# EAGLE design piezo-layer_v0.95-R002 (EAGLE 6.5.0)
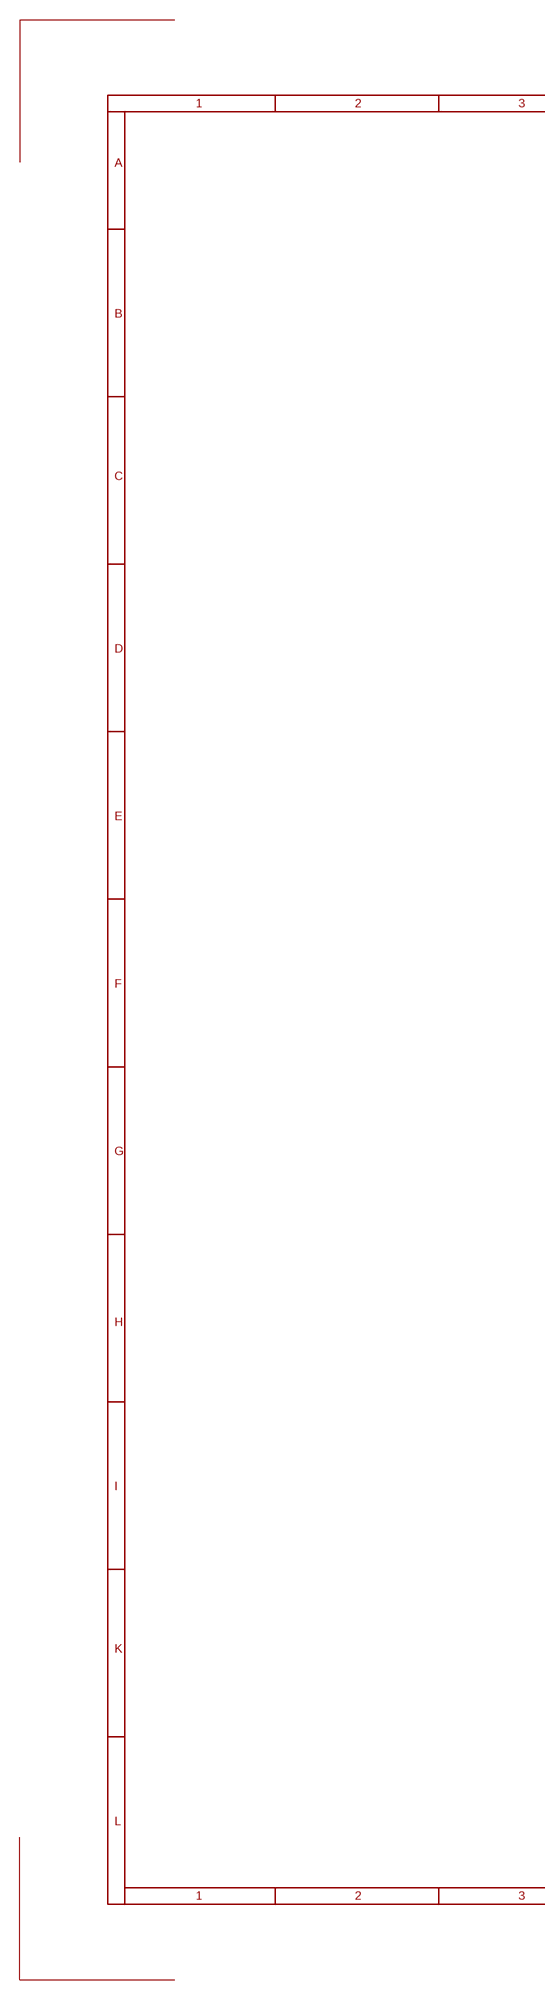
[diagram p0: schematic, sheet 1, part 1 of 2]
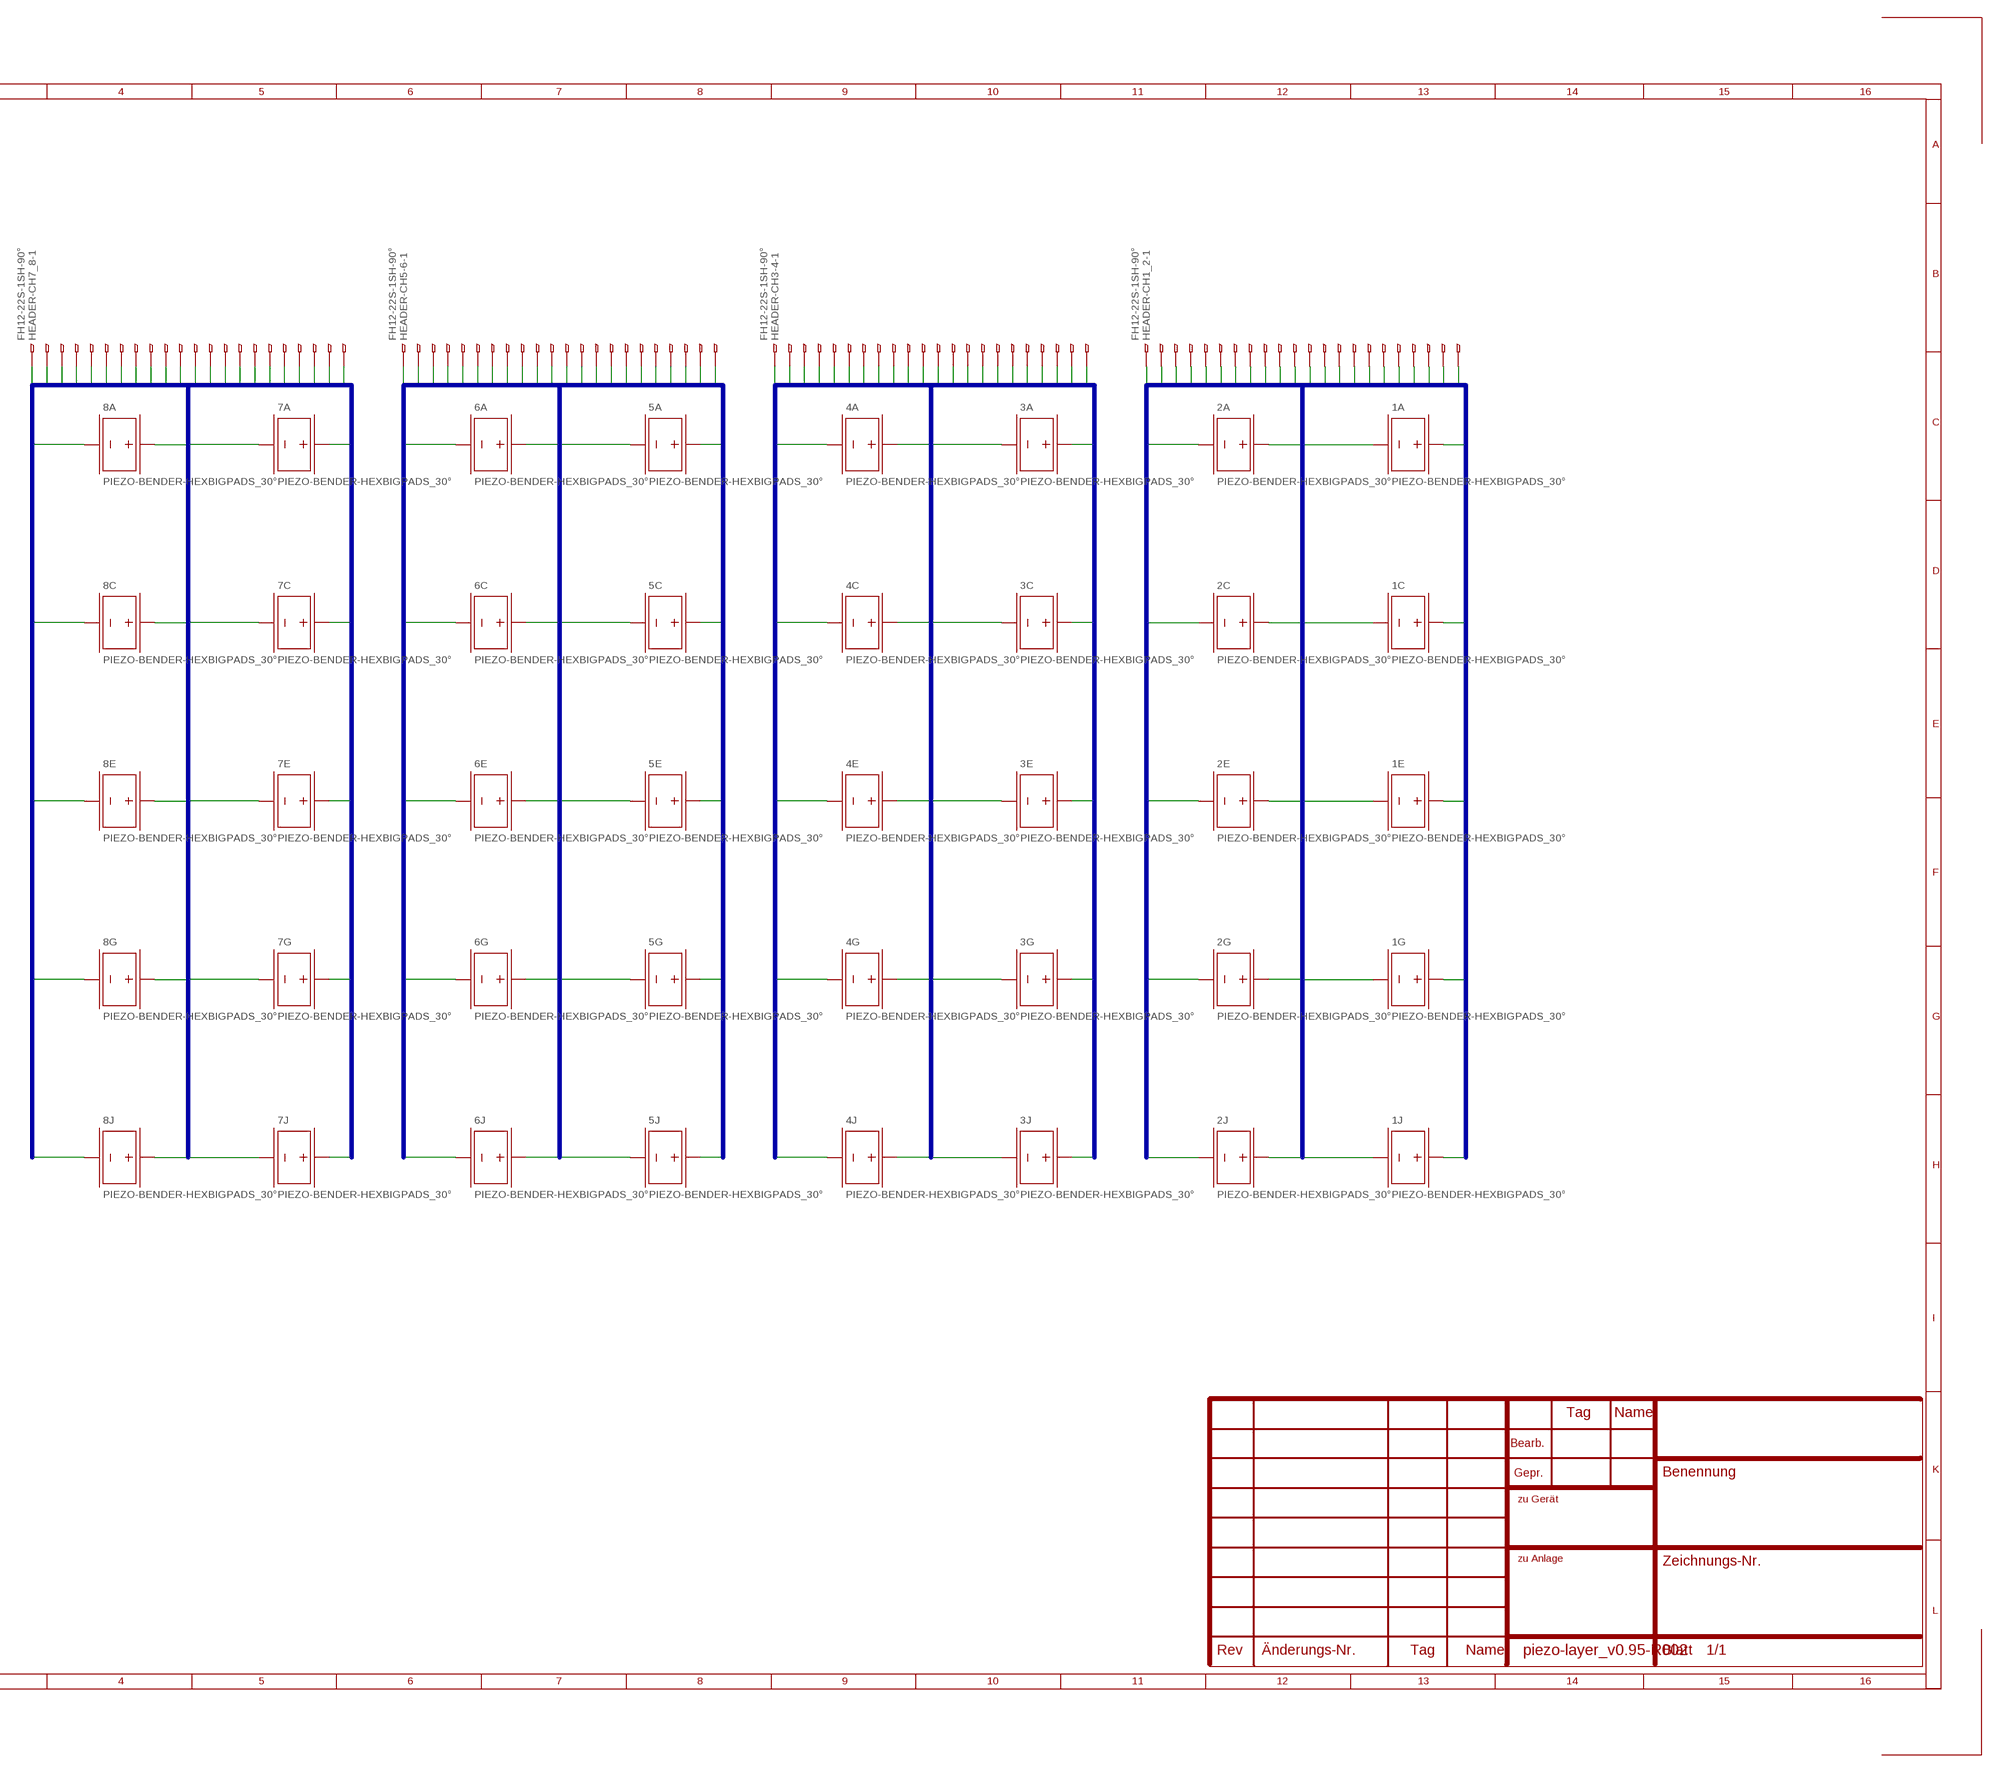
[diagram p1: schematic, sheet 1, part 2 of 2]

## Parts
1A  PIEZO-BENDER-HEXBIGPADS_30°  [PIEZO-BENDER-HEX_16MM_BIGPAD-30°]
1C  PIEZO-BENDER-HEXBIGPADS_30°  [PIEZO-BENDER-HEX_16MM_BIGPAD-30°]
1E  PIEZO-BENDER-HEXBIGPADS_30°  [PIEZO-BENDER-HEX_16MM_BIGPAD-30°]
1G  PIEZO-BENDER-HEXBIGPADS_30°  [PIEZO-BENDER-HEX_16MM_BIGPAD-30°]
1J  PIEZO-BENDER-HEXBIGPADS_30°  [PIEZO-BENDER-HEX_16MM_BIGPAD-30°]
2A  PIEZO-BENDER-HEXBIGPADS_30°  [PIEZO-BENDER-HEX_16MM_BIGPAD-30°]
2C  PIEZO-BENDER-HEXBIGPADS_30°  [PIEZO-BENDER-HEX_16MM_BIGPAD-30°]
2E  PIEZO-BENDER-HEXBIGPADS_30°  [PIEZO-BENDER-HEX_16MM_BIGPAD-30°]
2G  PIEZO-BENDER-HEXBIGPADS_30°  [PIEZO-BENDER-HEX_16MM_BIGPAD-30°]
2J  PIEZO-BENDER-HEXBIGPADS_30°  [PIEZO-BENDER-HEX_16MM_BIGPAD-30°]
3A  PIEZO-BENDER-HEXBIGPADS_30°  [PIEZO-BENDER-HEX_16MM_BIGPAD-30°]
3C  PIEZO-BENDER-HEXBIGPADS_30°  [PIEZO-BENDER-HEX_16MM_BIGPAD-30°]
3E  PIEZO-BENDER-HEXBIGPADS_30°  [PIEZO-BENDER-HEX_16MM_BIGPAD-30°]
3G  PIEZO-BENDER-HEXBIGPADS_30°  [PIEZO-BENDER-HEX_16MM_BIGPAD-30°]
3J  PIEZO-BENDER-HEXBIGPADS_30°  [PIEZO-BENDER-HEX_16MM_BIGPAD-30°]
4A  PIEZO-BENDER-HEXBIGPADS_30°  [PIEZO-BENDER-HEX_16MM_BIGPAD-30°]
4C  PIEZO-BENDER-HEXBIGPADS_30°  [PIEZO-BENDER-HEX_16MM_BIGPAD-30°]
4E  PIEZO-BENDER-HEXBIGPADS_30°  [PIEZO-BENDER-HEX_16MM_BIGPAD-30°]
4G  PIEZO-BENDER-HEXBIGPADS_30°  [PIEZO-BENDER-HEX_16MM_BIGPAD-30°]
4J  PIEZO-BENDER-HEXBIGPADS_30°  [PIEZO-BENDER-HEX_16MM_BIGPAD-30°]
5A  PIEZO-BENDER-HEXBIGPADS_30°  [PIEZO-BENDER-HEX_16MM_BIGPAD-30°]
5C  PIEZO-BENDER-HEXBIGPADS_30°  [PIEZO-BENDER-HEX_16MM_BIGPAD-30°]
5E  PIEZO-BENDER-HEXBIGPADS_30°  [PIEZO-BENDER-HEX_16MM_BIGPAD-30°]
5G  PIEZO-BENDER-HEXBIGPADS_30°  [PIEZO-BENDER-HEX_16MM_BIGPAD-30°]
5J  PIEZO-BENDER-HEXBIGPADS_30°  [PIEZO-BENDER-HEX_16MM_BIGPAD-30°]
6A  PIEZO-BENDER-HEXBIGPADS_30°  [PIEZO-BENDER-HEX_16MM_BIGPAD-30°]
6C  PIEZO-BENDER-HEXBIGPADS_30°  [PIEZO-BENDER-HEX_16MM_BIGPAD-30°]
6E  PIEZO-BENDER-HEXBIGPADS_30°  [PIEZO-BENDER-HEX_16MM_BIGPAD-30°]
6G  PIEZO-BENDER-HEXBIGPADS_30°  [PIEZO-BENDER-HEX_16MM_BIGPAD-30°]
6J  PIEZO-BENDER-HEXBIGPADS_30°  [PIEZO-BENDER-HEX_16MM_BIGPAD-30°]
7A  PIEZO-BENDER-HEXBIGPADS_30°  [PIEZO-BENDER-HEX_16MM_BIGPAD-30°]
7C  PIEZO-BENDER-HEXBIGPADS_30°  [PIEZO-BENDER-HEX_16MM_BIGPAD-30°]
7E  PIEZO-BENDER-HEXBIGPADS_30°  [PIEZO-BENDER-HEX_16MM_BIGPAD-30°]
7G  PIEZO-BENDER-HEXBIGPADS_30°  [PIEZO-BENDER-HEX_16MM_BIGPAD-30°]
7J  PIEZO-BENDER-HEXBIGPADS_30°  [PIEZO-BENDER-HEX_16MM_BIGPAD-30°]
8A  PIEZO-BENDER-HEXBIGPADS_30°  [PIEZO-BENDER-HEX_16MM_BIGPAD-30°]
8C  PIEZO-BENDER-HEXBIGPADS_30°  [PIEZO-BENDER-HEX_16MM_BIGPAD-30°]
8E  PIEZO-BENDER-HEXBIGPADS_30°  [PIEZO-BENDER-HEX_16MM_BIGPAD-30°]
8G  PIEZO-BENDER-HEXBIGPADS_30°  [PIEZO-BENDER-HEX_16MM_BIGPAD-30°]
8J  PIEZO-BENDER-HEXBIGPADS_30°  [PIEZO-BENDER-HEX_16MM_BIGPAD-30°]
HEADER-CH1_2  FH12-22S-1SH-90°  [FH12-22S-1SH]
HEADER-CH3-4  FH12-22S-1SH-90°  [FH12-22S-1SH]
HEADER-CH5-6  FH12-22S-1SH-90°  [FH12-22S-1SH]
HEADER-CH7_8  FH12-22S-1SH-90°  [FH12-22S-1SH]

## Nets
BUS1: 1A.TOP(+_1) HEADER-CH1_2.22
BUS2: HEADER-CH1_2.21
BUS3: 1C.TOP(+_1) HEADER-CH1_2.20
BUS4: HEADER-CH1_2.19
BUS5: 1A.BOTTOM(-_1) 1C.BOTTOM(-_1) 1E.BOTTOM(-_1) 1G.BOTTOM(-_1) 1J.BOTTOM(-_1) HEADER-CH1_2.12 HEADER-CH1_2.18
BUS6: 1E.TOP(+_1) HEADER-CH1_2.17
BUS7: HEADER-CH1_2.16
BUS8: 1G.TOP(+_1) HEADER-CH1_2.15
BUS9: HEADER-CH1_2.14
BUS10: 1J.TOP(+_1) HEADER-CH1_2.13
BUS11: 2A.TOP(+_1) HEADER-CH1_2.11
BUS12: HEADER-CH1_2.10
BUS13: 2C.TOP(+_1) HEADER-CH1_2.9
BUS14: HEADER-CH1_2.8
BUS15: 2A.BOTTOM(-_1) 2C.BOTTOM(-_1) 2E.BOTTOM(-_1) 2G.BOTTOM(-_1) 2J.BOTTOM(-_1) HEADER-CH1_2.1 HEADER-CH1_2.7
BUS16: 2E.TOP(+_1) HEADER-CH1_2.6
BUS17: HEADER-CH1_2.5
BUS18: 2G.TOP(+_1) HEADER-CH1_2.4
BUS19: HEADER-CH1_2.3
BUS20: 2J.TOP(+_1) HEADER-CH1_2.2
BUS21: 3A.TOP(+_1) HEADER-CH3-4.22
BUS22: HEADER-CH3-4.21
BUS23: 3C.TOP(+_1) HEADER-CH3-4.20
BUS24: HEADER-CH3-4.19
BUS25: 3A.BOTTOM(-_1) 3C.BOTTOM(-_1) 3E.BOTTOM(-_1) 3G.BOTTOM(-_1) 3J.BOTTOM(-_1) HEADER-CH3-4.12 HEADER-CH3-4.18
BUS26: 3E.TOP(+_1) HEADER-CH3-4.17
BUS27: HEADER-CH3-4.16
BUS28: 3G.TOP(+_1) HEADER-CH3-4.15
BUS29: HEADER-CH3-4.14
BUS30: 3J.TOP(+_1) HEADER-CH3-4.13
BUS31: 4A.TOP(+_1) HEADER-CH3-4.11
BUS32: HEADER-CH3-4.10
BUS33: 4C.TOP(+_1) HEADER-CH3-4.9
BUS34: HEADER-CH3-4.8
BUS35: 4A.BOTTOM(-_1) 4C.BOTTOM(-_1) 4E.BOTTOM(-_1) 4G.BOTTOM(-_1) 4J.BOTTOM(-_1) HEADER-CH3-4.1 HEADER-CH3-4.7
BUS36: 4E.TOP(+_1) HEADER-CH3-4.6
BUS37: HEADER-CH3-4.5
BUS38: 4G.TOP(+_1) HEADER-CH3-4.4
BUS39: HEADER-CH3-4.3
BUS40: 4J.TOP(+_1) HEADER-CH3-4.2
BUS41: 5A.TOP(+_1) HEADER-CH5-6.22
BUS42: HEADER-CH5-6.21
BUS43: 5C.TOP(+_1) HEADER-CH5-6.20
BUS44: HEADER-CH5-6.19
BUS45: 5A.BOTTOM(-_1) 5C.BOTTOM(-_1) 5E.BOTTOM(-_1) 5G.BOTTOM(-_1) 5J.BOTTOM(-_1) HEADER-CH5-6.12 HEADER-CH5-6.18
BUS46: 5E.TOP(+_1) HEADER-CH5-6.17
BUS47: HEADER-CH5-6.16
BUS48: 5G.TOP(+_1) HEADER-CH5-6.15
BUS49: HEADER-CH5-6.14
BUS50: 5J.TOP(+_1) HEADER-CH5-6.13
BUS51: 6A.TOP(+_1) HEADER-CH5-6.11
BUS52: HEADER-CH5-6.10
BUS53: 6C.TOP(+_1) HEADER-CH5-6.9
BUS54: HEADER-CH5-6.8
BUS55: 6A.BOTTOM(-_1) 6C.BOTTOM(-_1) 6E.BOTTOM(-_1) 6G.BOTTOM(-_1) 6J.BOTTOM(-_1) HEADER-CH5-6.1 HEADER-CH5-6.7
BUS56: 6E.TOP(+_1) HEADER-CH5-6.6
BUS57: HEADER-CH5-6.5
BUS58: 6G.TOP(+_1) HEADER-CH5-6.4
BUS59: HEADER-CH5-6.3
BUS60: 6J.TOP(+_1) HEADER-CH5-6.2
BUS61: 7A.TOP(+_1) HEADER-CH7_8.22
BUS62: HEADER-CH7_8.21
BUS63: 7C.TOP(+_1) HEADER-CH7_8.20
BUS64: HEADER-CH7_8.19
BUS65: 7A.BOTTOM(-_1) 7C.BOTTOM(-_1) 7E.BOTTOM(-_1) 7G.BOTTOM(-_1) 7J.BOTTOM(-_1) HEADER-CH7_8.12 HEADER-CH7_8.18
BUS66: 7E.TOP(+_1) HEADER-CH7_8.17
BUS67: HEADER-CH7_8.16
BUS68: 7G.TOP(+_1) HEADER-CH7_8.15
BUS69: HEADER-CH7_8.14
BUS70: 7J.TOP(+_1) HEADER-CH7_8.13
BUS71: 8A.TOP(+_1) HEADER-CH7_8.11
BUS72: HEADER-CH7_8.10
BUS73: 8C.TOP(+_1) HEADER-CH7_8.9
BUS74: HEADER-CH7_8.8
BUS75: 8A.BOTTOM(-_1) 8C.BOTTOM(-_1) 8E.BOTTOM(-_1) 8G.BOTTOM(-_1) 8J.BOTTOM(-_1) HEADER-CH7_8.1 HEADER-CH7_8.7
BUS76: 8E.TOP(+_1) HEADER-CH7_8.6
BUS77: HEADER-CH7_8.5
BUS78: 8G.TOP(+_1) HEADER-CH7_8.4
BUS79: HEADER-CH7_8.3
BUS80: 8J.TOP(+_1) HEADER-CH7_8.2

## Buses
BUS[1..20]
BUS[21..40]
BUS[41..60]
BUS[61..80]

## Library data of the parts
1A 1C 1E 1G 1J 2A 2C 2E 2G 2J 3A 3C 3E 3G 3J 4A 4C 4E 4G 4J 5A 5C 5E 5G 5J 6A 6C 6E 6G 6J 7A 7C 7E 7G 7J 8A 8C 8E 8G 8J = ICST:PIEZO-BENDER-HEX
HEADER-CH1_2 HEADER-CH3-4 HEADER-CH5-6 HEADER-CH7_8 = ICST:FH12-22S-1SH

## Board
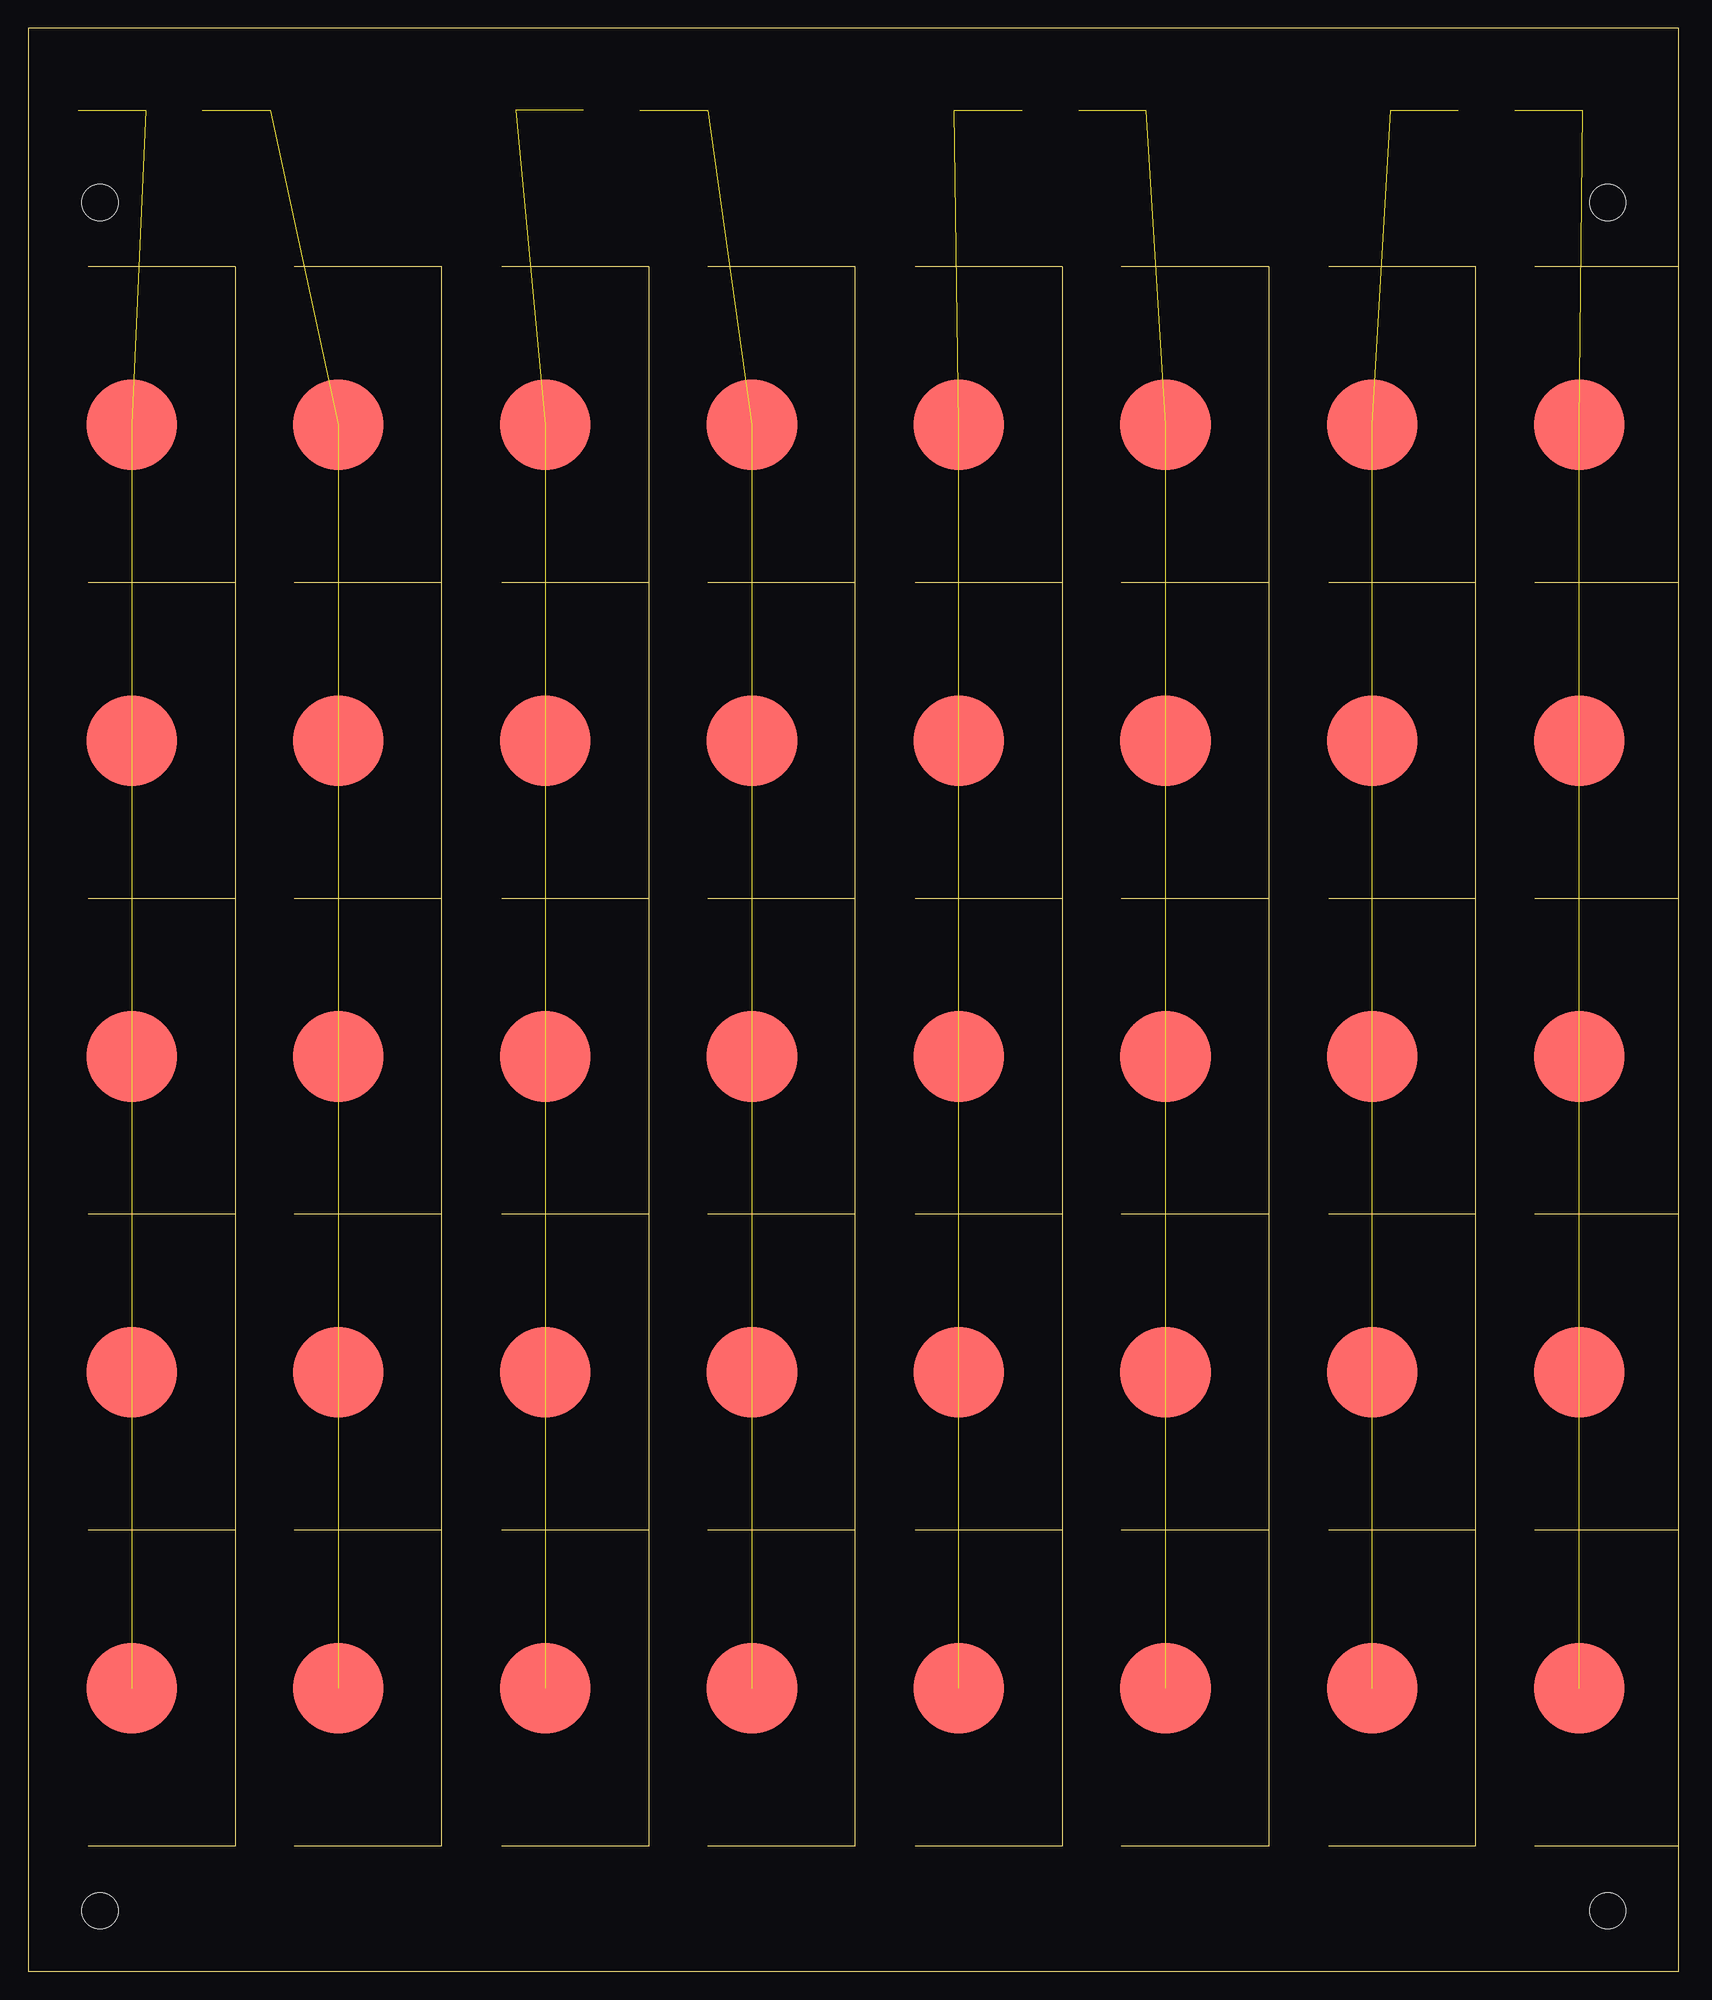
[diagram p2: board, top side]
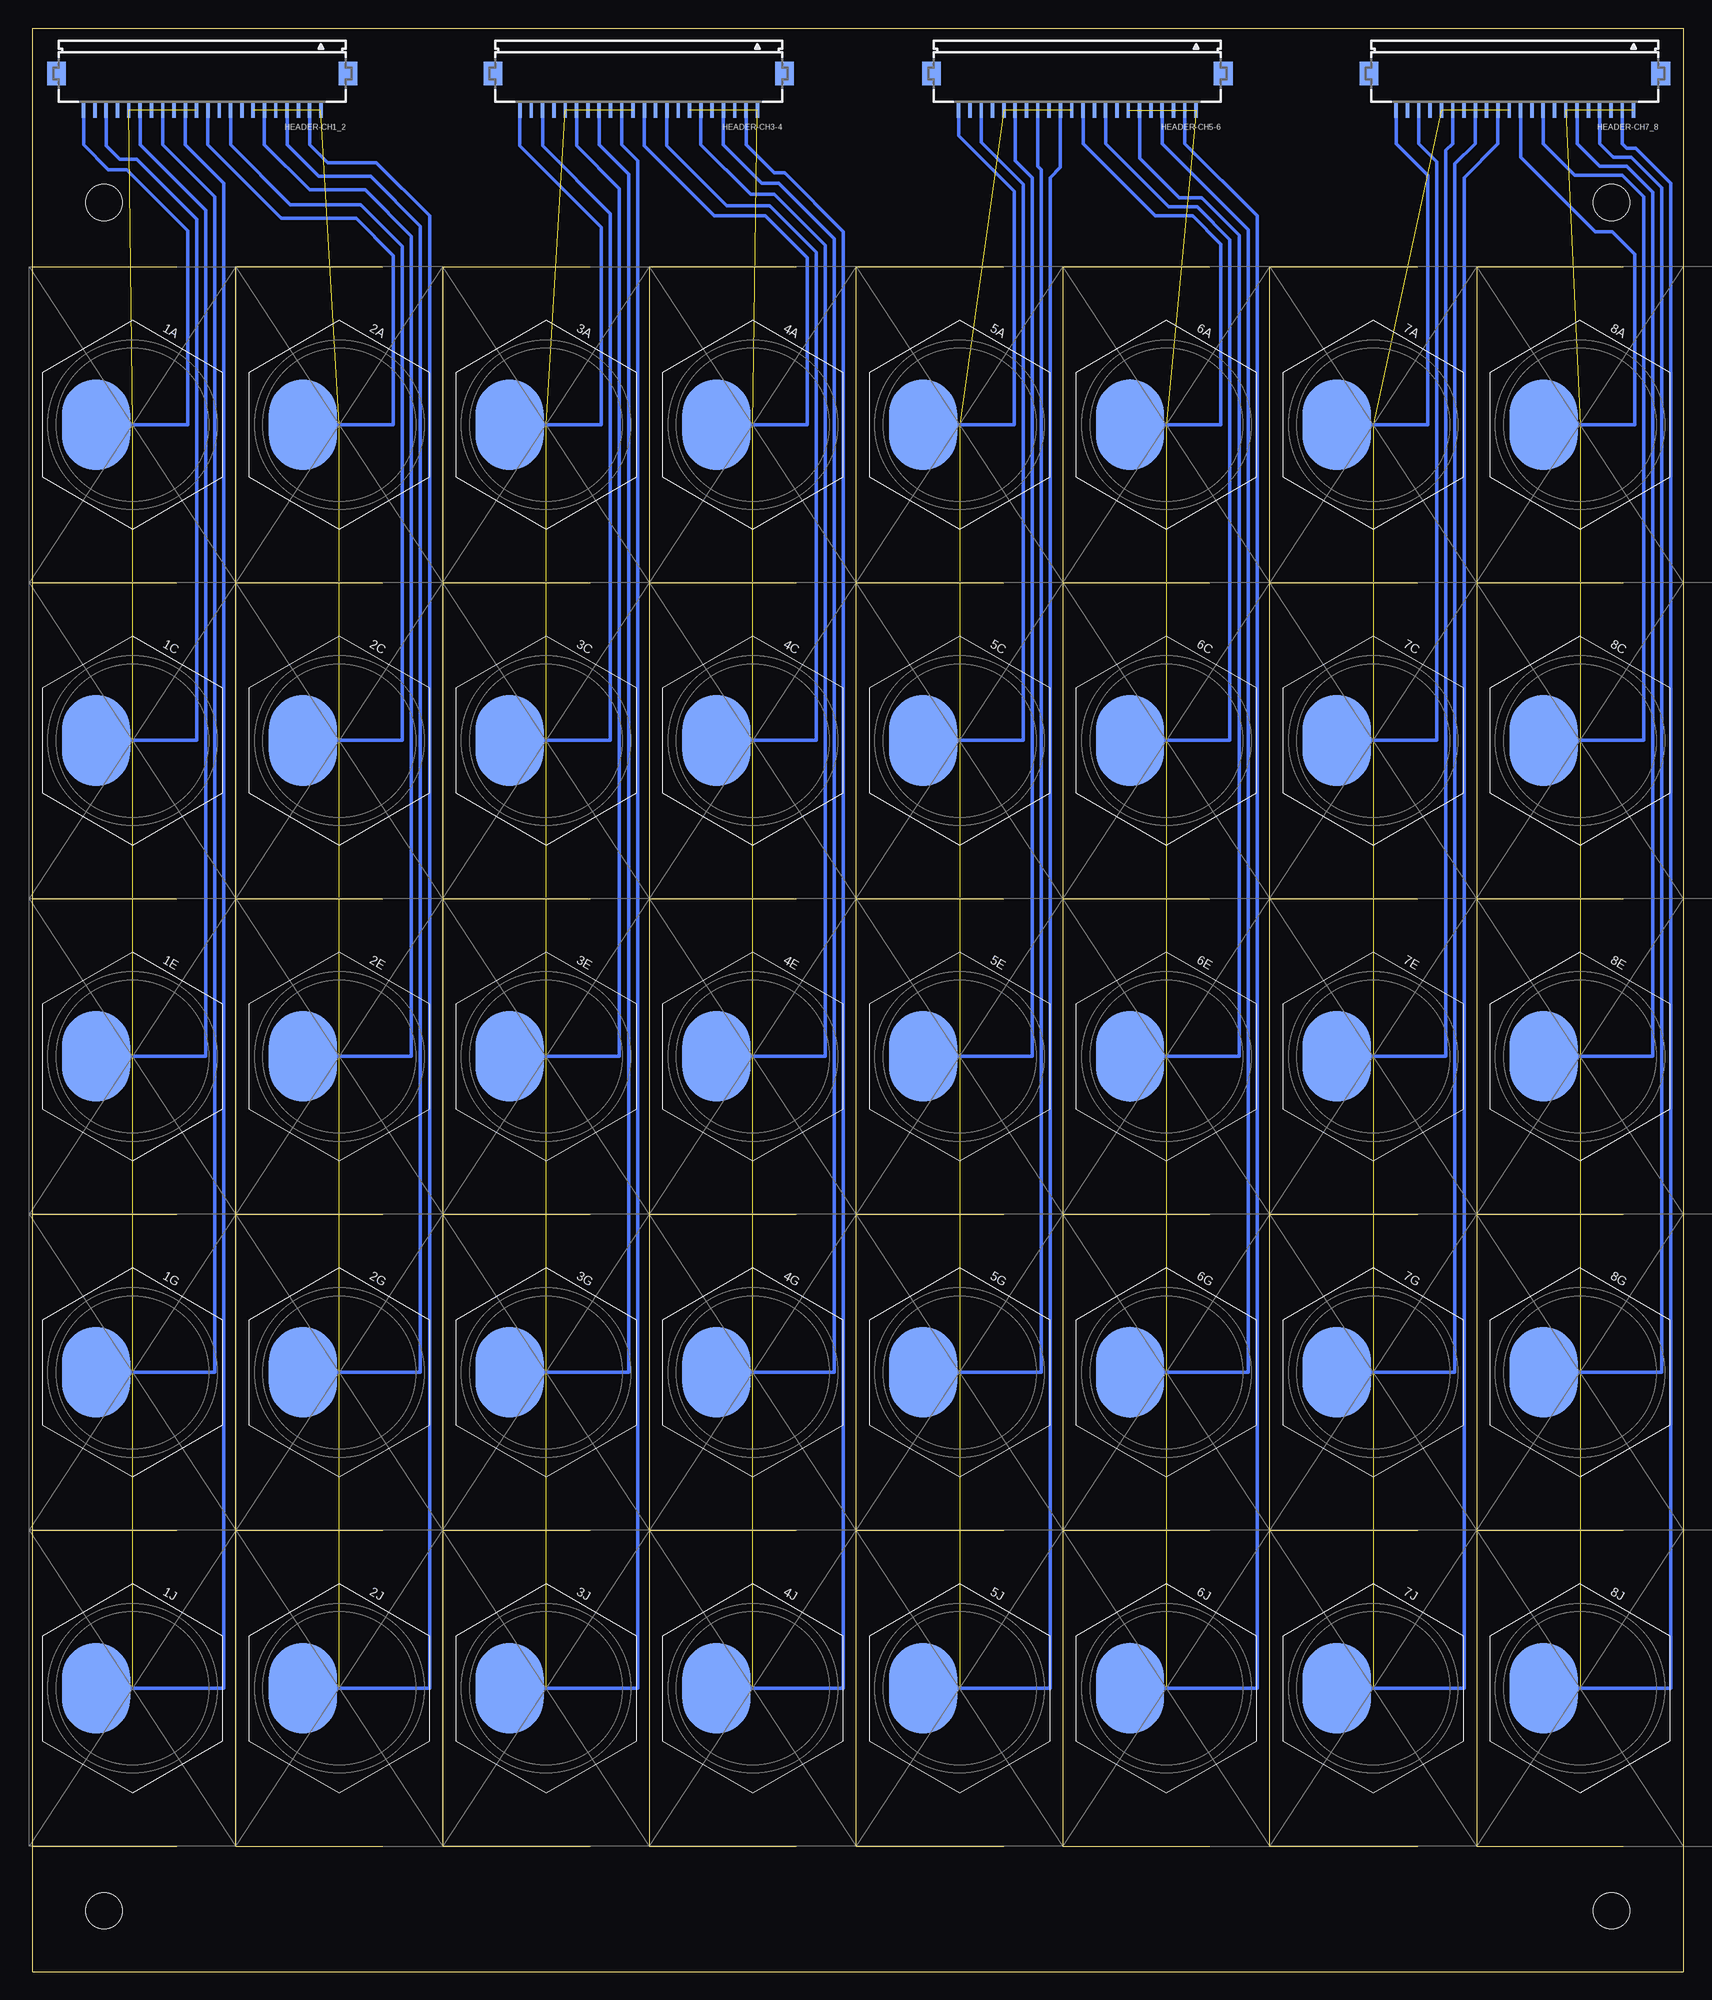
[diagram p3: board, bottom side, seen from below]

Size 146 x 171.9 mm. Coordinates in mm from the lower left corner, seen from the top.
Outline: 146,11.1 146,0 0,0 0,171.9 146,171.9 146,150.8
Outline: 146,11.1 146,39.04
Outline: 146,39.04 146,66.98
Outline: 146,66.98 146,94.92
Outline: 146,94.92 146,122.86
Outline: 146,122.86 146,150.8
Outline: 128.03,39.04 128.03,11.1 115.05,11.1
Outline: 128.03,39.04 128.03,66.98
Outline: 128.03,66.98 128.03,94.92
Outline: 128.03,94.92 128.03,122.86
Outline: 128.03,122.86 128.03,150.8 115.05,150.8
Outline: 109.74,122.86 109.74,150.8 96.67,150.8
Outline: 109.74,122.86 109.74,94.92
Outline: 109.74,94.92 109.74,66.98
Outline: 109.74,66.98 109.74,39.04
Outline: 109.74,39.04 109.74,11.1 96.67,11.1
Outline: 91.45,122.86 91.45,150.8 78.47,150.8
Outline: 91.45,122.86 91.45,94.92
Outline: 91.45,94.92 91.45,66.98
Outline: 91.45,66.98 91.45,39.04
Outline: 91.45,39.04 91.45,11.1 78.47,11.1
Outline: 73.16,122.86 73.16,11.1 60.09,11.1
Outline: 73.16,122.86 73.16,150.8 60.09,150.8
Outline: 54.87,122.86 54.87,150.8 41.89,150.8
Outline: 54.87,122.86 54.87,11.1 41.89,11.1
Outline: 128.03,122.86 115.05,122.86
Outline: 146,150.8 133.25,150.8
Outline: 146,122.86 133.25,122.86
Outline: 146,94.92 133.25,94.92
Outline: 128.03,94.92 115.05,94.92
Outline: 128.03,66.98 115.05,66.98
Outline: 146,66.98 133.25,66.98
Outline: 146,39.04 133.25,39.04
Outline: 128.03,39.04 115.05,39.04
Outline: 146,11.1 133.25,11.1
Outline: 109.74,122.86 96.67,122.86
Outline: 91.45,122.86 78.47,122.86
Outline: 109.74,94.92 96.67,94.92
Outline: 91.45,94.92 78.47,94.92
Outline: 91.45,66.98 78.47,66.98
Outline: 109.74,66.98 96.67,66.98
Outline: 109.74,39.04 96.67,39.04
Outline: 91.45,39.04 78.47,39.04
Outline: 73.16,94.92 60.09,94.92
Outline: 54.87,94.92 41.89,94.92
Outline: 73.16,66.98 60.09,66.98
Outline: 54.87,66.98 41.89,66.98
Outline: 73.16,39.04 60.11,39.04
Outline: 54.87,39.04 41.89,39.04
Outline: 23.51,150.8 36.58,150.8 36.58,11.1 23.51,11.1
Outline: 5.31,150.8 18.29,150.8 18.29,11.1 5.31,11.1
Outline: 36.58,122.86 23.51,122.86
Outline: 18.29,122.86 5.31,122.86
Outline: 36.58,94.92 23.51,94.92
Outline: 18.29,94.92 5.31,94.92
Outline: 18.29,66.98 5.31,66.98
Outline: 36.58,66.98 23.51,66.98
Outline: 36.58,39.04 23.51,39.04
Outline: 18.29,39.04 5.31,39.04
Outline: 73.16,122.86 60.09,122.86
Outline: 54.87,122.86 41.89,122.86
Copper layers 1*16: Top 0.012mm / dielectric 0.025mm / Bottom 0.012mm
Design rules "1L-0.025-0.15_0.3mm *": minimum track width 0.2mm, minimum drill 0.3mm, track to track 0.15mm, track to pad 0.15mm, pad to pad 0.15mm, via to via 0.15mm, smd to smd 0.15mm, copper to edge 0.5mm, drill to drill 1mm, minimum pad ring 10mil, minimum via ring 8mil, stop-mask expansion 4mil, vias tented up to drill 0mil, thermal gap 10mil
Holes 3.2 mm at 6.35,156.5 139.7,156.5 6.35,5.4 139.7,5.4

### Footprints (pad centres in the part's own frame; a part is rotated, then mirrored left to right if it is on the bottom)
PIEZO-BENDER-HEX_16MM_BIGPAD-30° = smd 8 x 8 bottom: BOTTOM 0,0 | smd 6 x 8 rotated 210: TOP -2.8,-1.6
FH12-22S-1SH = smd 0.3 x 1.3: 1 -10.5,3.25; 2 -9.5,3.25; 3 -8.5,3.25; 4 -7.5,3.25; 5 -6.5,3.25; 6 -5.5,3.25; 7 -4.5,3.25; 8 -3.5,3.25; 9 -2.5,3.25; 10 -1.5,3.25; 11 -0.5,3.25; 12 0.5,3.25; 13 1.5,3.25; 14 2.5,3.25; 15 3.5,3.25; 16 4.5,3.25; 17 5.5,3.25; 18 6.5,3.25; 19 7.5,3.25; 20 8.5,3.25; 21 9.5,3.25; 22 10.5,3.25 | smd 1.65 x 2.05: PAD1 -12.9,0; PAD2 12.9,0

### Placement (x,y rotation side)
1A  137.17,136.83 330 bottom
1C  137.17,108.89 330 bottom
1E  137.17,80.95 330 bottom
1G  137.17,53.01 330 bottom
1J  137.17,25.07 330 bottom
2A  118.88,136.83 330 bottom
2C  118.88,108.89 330 bottom
2E  118.88,80.95 330 bottom
2G  118.88,53.01 330 bottom
2J  118.88,25.07 330 bottom
3A  100.59,136.83 330 bottom
3C  100.59,108.89 330 bottom
3E  100.59,80.95 330 bottom
3G  100.59,53.01 330 bottom
3J  100.59,25.07 330 bottom
4A  82.3,136.83 330 bottom
4C  82.3,108.89 330 bottom
4E  82.3,80.95 330 bottom
4G  82.3,53.01 330 bottom
4J  82.3,25.07 330 bottom
5A  64.01,136.83 330 bottom
5C  64.01,108.89 330 bottom
5E  64.01,80.95 330 bottom
5G  64.01,53.01 330 bottom
5J  64.01,25.07 330 bottom
6A  45.72,136.83 330 bottom
6C  45.72,108.89 330 bottom
6E  45.72,80.95 330 bottom
6G  45.72,53.01 330 bottom
6J  45.72,25.07 330 bottom
7A  27.43,136.83 330 bottom
7C  27.43,108.89 330 bottom
7E  27.43,80.95 330 bottom
7G  27.43,53.01 330 bottom
7J  27.43,25.07 330 bottom
8A  9.14,136.83 330 bottom
8C  9.14,108.89 330 bottom
8E  9.14,80.95 330 bottom
8G  9.14,53.01 330 bottom
8J  9.14,25.07 330 bottom
HEADER-CH1_2  131,167.9 180 bottom
HEADER-CH3-4  92.4,167.9 180 bottom
HEADER-CH5-6  53.6,167.9 180 bottom
HEADER-CH7_8  14.9,167.9 180 bottom

### Tracks (layer width: path | path; a pad name or v marks a point on that pad's centre or on a via)
BUS1
  Bottom 0.3: 1A.TOP 132.3,136.84 132.3,154 137.7,159.4 139.3,159.4 141.5,161.6 HEADER-CH1_2.22
BUS3
  Bottom 0.3: 1C.TOP 131.5,108.9 131.5,155 136.8,160.3 138.3,160.3 139.5,161.5 HEADER-CH1_2.20
BUS5  (6 unrouted)
BUS6
  Bottom 0.3: 1E.TOP 130.7,80.96 130.7,155.8 136.5,161.6 HEADER-CH1_2.17
BUS8
  Bottom 0.3: 1G.TOP 129.9,53.02 129.9,157 134.5,161.6 HEADER-CH1_2.15
BUS10
  Bottom 0.3: 1J.TOP 129.1,25.08 129.1,158.2 132.5,161.6 HEADER-CH1_2.13
BUS11
  Bottom 0.3: 2A.TOP 114.1,136.84 114.1,151.8 117.4,155.1 124,155.1 130.5,161.6 HEADER-CH1_2.11
BUS13
  Bottom 0.3: 2C.TOP 113.3,108.9 113.3,152.6 117,156.3 123.2,156.3 128.5,161.6 HEADER-CH1_2.9
BUS15  (6 unrouted)
BUS16
  Bottom 0.3: 2E.TOP 112.5,80.96 112.5,153.5 116.6,157.6 121.5,157.6 125.5,161.6 HEADER-CH1_2.6
BUS18
  Bottom 0.3: 2G.TOP 111.7,53.02 111.7,154.4 116.1,158.8 120.7,158.8 123.5,161.6 HEADER-CH1_2.4
BUS20
  Bottom 0.3: 2J.TOP 110.9,25.08 110.9,155.3 115.6,160 119.9,160 121.5,161.6 HEADER-CH1_2.2
BUS21
  Bottom 0.3: 3A.TOP 95.7,136.84 95.7,154.3 102.9,161.5 HEADER-CH3-4.22
BUS23
  Bottom 0.3: 3C.TOP 94.9,108.9 94.9,155.5 100.9,161.5 HEADER-CH3-4.20
BUS25  (6 unrouted)
BUS26
  Bottom 0.3: 3E.TOP 94.1,80.96 94.1,157.7 97.9,161.5 HEADER-CH3-4.17
BUS28
  Bottom 0.3: 3G.TOP 93.3,53.02 93.3,159 95.9,161.6 HEADER-CH3-4.15
BUS30
  Bottom 0.3: 3J.TOP 92.5,25.08 92.5,160.2 93.9,161.6 HEADER-CH3-4.13
BUS31
  Bottom 0.3: 4A.TOP 77.5,136.84 77.5,151.6 81.2,155.3 85.7,155.3 91.9,161.5 HEADER-CH3-4.11
BUS33
  Bottom 0.3: 4C.TOP 76.7,108.9 76.7,152.1 80.8,156.2 84.6,156.2 89.9,161.5 HEADER-CH3-4.9
BUS35  (6 unrouted)
BUS36
  Bottom 0.3: 4E.TOP 75.9,80.96 75.9,152.7 80.4,157.2 82.5,157.2 86.9,161.6 HEADER-CH3-4.6
BUS38
  Bottom 0.3: 4G.TOP 75.1,53.02 75.1,153.3 80,158.2 81.5,158.2 84.9,161.6 HEADER-CH3-4.4
BUS40
  Bottom 0.3: 4J.TOP 74.3,25.08 74.3,153.9 79.5,159.1 80.4,159.1 82.9,161.6 HEADER-CH3-4.2
BUS41
  Bottom 0.3: 5A.TOP 59.2,136.84 59.2,157.5 64.1,162.4 HEADER-CH5-6.22
BUS43
  Bottom 0.3: 5C.TOP 58.4,108.9 58.4,158.1 62.1,161.8 HEADER-CH5-6.20
BUS45  (6 unrouted)
BUS46
  Bottom 0.3: 5E.TOP 57.6,80.96 57.6,158.7 59.1,160.2 HEADER-CH5-6.17
BUS48
  Bottom 0.3: 5G.TOP 56.8,53.02 56.8,159.4 57.1,159.7 HEADER-CH5-6.15
BUS50
  Bottom 0.3: 5J.TOP 56,25.08 56,158.7 55.1,159.6 HEADER-CH5-6.13
BUS51
  Bottom 0.3: 6A.TOP 40.9,136.84 40.9,152.8 43.4,155.3 46.7,155.3 53.1,161.7 HEADER-CH5-6.11
BUS53
  Bottom 0.3: 6C.TOP 40.1,108.9 40.1,153.2 43,156.1 45.5,156.1 51.1,161.7 HEADER-CH5-6.9
BUS55  (6 unrouted)
BUS56
  Bottom 0.3: 6E.TOP 39.3,80.96 39.3,153.6 42.6,156.9 44.6,156.9 48.1,160.4 HEADER-CH5-6.6
BUS58
  Bottom 0.3: 6G.TOP 38.5,53.02 38.5,154.1 46.1,161.7 HEADER-CH5-6.4
BUS60
  Bottom 0.3: 6J.TOP 37.7,25.08 37.7,155.3 44.1,161.7 HEADER-CH5-6.2
BUS61
  Bottom 0.3: 7A.TOP 22.6,136.84 22.6,158.9 25.4,161.7 HEADER-CH7_8.22
BUS63
  Bottom 0.3: 7C.TOP 21.8,108.9 21.8,160.1 23.4,161.7 HEADER-CH7_8.20
BUS65  (6 unrouted)
BUS66
  Bottom 0.3: 7E.TOP 21,80.96 21,161.1 20.4,161.7 HEADER-CH7_8.17
BUS68
  Bottom 0.3: 7G.TOP 20.2,53.02 20.2,159.9 18.4,161.7 HEADER-CH7_8.15
BUS70
  Bottom 0.3: 7J.TOP 19.4,25.08 19.4,158.7 16.4,161.7 HEADER-CH7_8.13
BUS71
  Bottom 0.3: 8A.TOP 4.3,136.84 4.3,151.9 6.3,153.9 7.8,153.9 14.4,160.5 HEADER-CH7_8.11
BUS73
  Bottom 0.3: 8C.TOP 3.5,108.9 3.5,157 5.4,158.9 9.6,158.9 12.4,161.7 HEADER-CH7_8.9
BUS75  (6 unrouted)
BUS76
  Bottom 0.3: 8E.TOP 2.7,80.96 2.7,157.4 5,159.7 7.4,159.7 9.4,161.7 HEADER-CH7_8.6
BUS78
  Bottom 0.3: 8G.TOP 1.9,53.02 1.9,157.8 4.6,160.5 6.2,160.5 7.4,161.7 HEADER-CH7_8.4
BUS80
  Bottom 0.3: 8J.TOP 1.1,25.08 1.1,158.2 4.2,161.3 5,161.3 5.4,161.7 HEADER-CH7_8.2